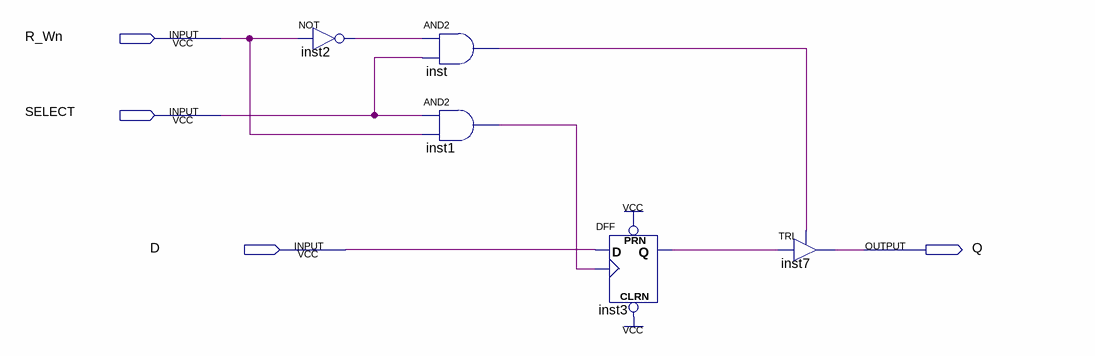
[diagram p0: schematic sheet]
// Quartus schematic CI74F189_CELL.bdf as structural Verilog: 5 symbols, 4 pins
module CI74F189_CELL (
  input  R_Wn,
  input  SELECT,
  input  D,
  output Q
);

  wire inst1_out, inst2_out, inst3_q, inst_out;

  not inst2 (inst2_out, R_Wn);
  and inst (inst_out, inst2_out, SELECT);
  and inst1 (inst1_out, SELECT, R_Wn);
  DFF inst3 (.CLRN(1'b1), .CLK(inst1_out), .D(D), .PRN(1'b1), .Q(inst3_q));
  TRI inst7 (.IN(inst3_q), .OE(inst_out), .OUT(Q));
endmodule
